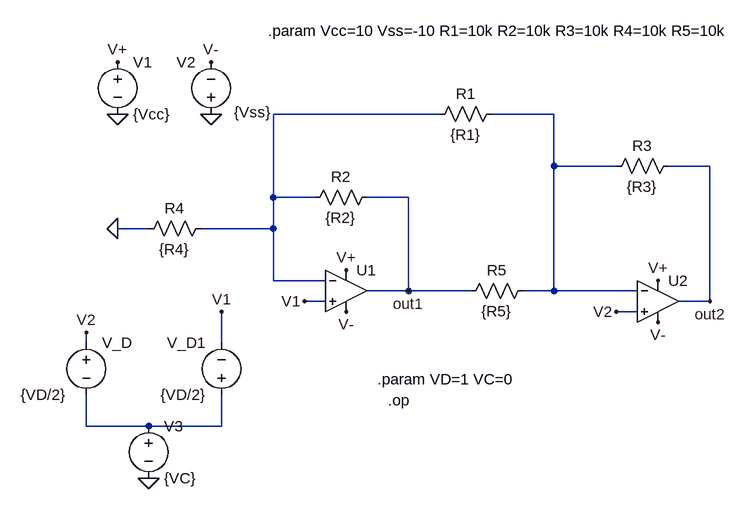
[diagram p0: schematic LAB1_OP.asc]
LAB1_OP.asc, the LTspice schematic file:
Version 4
SHEET 1 880 680
WIRE 256 -64 0 -64
WIRE 432 -64 336 -64
WIRE 432 16 432 -64
WIRE 528 16 432 16
WIRE 672 16 608 16
WIRE 0 64 0 -64
WIRE 64 64 0 64
WIRE 208 64 144 64
WIRE -192 112 -240 112
WIRE 0 112 0 64
WIRE 0 112 -112 112
WIRE 0 192 0 112
WIRE 80 192 0 192
WIRE 208 208 208 64
WIRE 208 208 144 208
WIRE 304 208 208 208
WIRE 432 208 432 16
WIRE 432 208 384 208
WIRE 560 208 432 208
WIRE 80 224 48 224
WIRE 672 224 672 16
WIRE 672 224 624 224
WIRE 560 240 528 240
WIRE -288 288 -288 272
WIRE -80 288 -80 240
WIRE -288 416 -288 368
WIRE -192 416 -288 416
WIRE -80 416 -80 368
WIRE -80 416 -192 416
FLAG -240 112 0
FLAG 672 224 out2
FLAG 208 208 out1
FLAG 528 240 V2
FLAG 48 224 V1
FLAG -96 -64 0
FLAG -240 -64 0
FLAG -240 -144 V+
FLAG 112 176 V+
FLAG 592 192 V+
FLAG -96 -144 V-
FLAG 112 240 V-
FLAG 592 256 V-
FLAG -288 272 V2
FLAG -80 240 V1
FLAG -192 496 0
SYMBOL res 352 -80 R90
WINDOW 0 0 56 VBottom 2
WINDOW 3 32 56 VTop 2
SYMATTR InstName R1
SYMATTR Value {R1}
SYMBOL res 160 48 R90
WINDOW 0 0 56 VBottom 2
WINDOW 3 32 56 VTop 2
SYMATTR InstName R2
SYMATTR Value {R2}
SYMBOL res 624 0 R90
WINDOW 0 0 56 VBottom 2
WINDOW 3 32 56 VTop 2
SYMATTR InstName R3
SYMATTR Value {R3}
SYMBOL res -96 96 R90
WINDOW 0 0 56 VBottom 2
WINDOW 3 32 56 VTop 2
SYMATTR InstName R4
SYMATTR Value {R4}
SYMBOL res 400 192 R90
WINDOW 0 0 56 VBottom 2
WINDOW 3 32 56 VTop 2
SYMATTR InstName R5
SYMATTR Value {R5}
SYMBOL OpAmps\\UniversalOpamp2 112 208 R0
SYMATTR InstName U1
SYMATTR SpiceModel level.1
SYMATTR SpiceLine2 ""
SYMBOL OpAmps\\UniversalOpamp2 592 224 R0
SYMATTR InstName U2
SYMATTR SpiceModel level.1
SYMATTR SpiceLine ""
SYMATTR SpiceLine2 ""
SYMBOL voltage -240 -160 R0
SYMATTR InstName V1
SYMATTR Value {Vcc}
SYMBOL voltage -96 -48 R180
WINDOW 0 24 96 Left 2
WINDOW 3 -92 19 Left 2
SYMATTR InstName V2
SYMATTR Value {Vss}
SYMBOL voltage -288 272 R0
WINDOW 3 -101 96 Left 2
SYMATTR InstName V_D
SYMATTR Value {VD/2}
SYMBOL voltage -80 384 R180
WINDOW 0 24 96 Left 2
WINDOW 3 24 16 Left 2
SYMATTR InstName V_D1
SYMATTR Value {VD/2}
SYMBOL voltage -192 400 R0
WINDOW 123 0 0 Left 0
WINDOW 39 0 0 Left 0
SYMATTR InstName V3
SYMATTR Value {VC}
TEXT -8 -192 Left 2 !.param Vcc=10 Vss=-10 R1=10k R2=10k R3=10k R4=10k R5=10k
TEXT 160 344 Left 2 !.param VD=1 VC=0
TEXT 176 376 Left 2 !.op

The netlist it stands for:
* LAB1_OP.asc
R1 N002 N001 {R1}
R2 out1 N001 {R2}
R3 out2 N002 {R3}
R4 N001 0 {R4}
R5 N002 out1 {R5}
XU1 V1 N001 V+ V- out1 level.1 Avol=1Meg GBW=10Meg Slew=10Meg ilimit=25m rail=0 Vos=0 phimargin=45  ; pins IN+ IN- V+ V- OUT
XU2 V2 N002 V+ V- out2 level.1 Avol=1Meg GBW=10Meg Slew=10Meg  ; pins IN+ IN- V+ V- OUT
V1 V+ 0 {Vcc}
V2 0 V- {Vss}
V_D V2 N003 {VD/2}
V_D1 N003 V1 {VD/2}
V3 N003 0 {VC}
.param Vcc=10 Vss=-10 R1=10k R2=10k R3=10k R4=10k R5=10k
.param VD=1 VC=0
.op
.lib UniversalOpamps2.sub
.backanno
.end